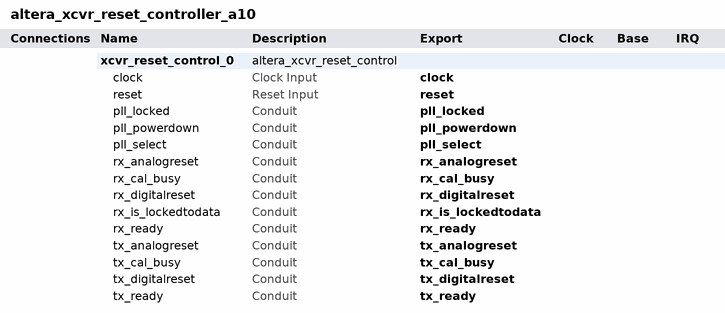
[diagram p0: system contents]
# Platform Designer (Qsys) system altera_xcvr_reset_controller_a10, Arria 10 10AX115S4F45E3SGE3
# Parameters at their usual value, and those the tool derives, are not listed.
package require -exact qsys 16.0
create_system altera_xcvr_reset_controller_a10
set_project_property DEVICE_FAMILY {Arria 10}
set_project_property DEVICE 10AX115S4F45E3SGE3

add_instance xcvr_reset_control_0 altera_xcvr_reset_control 16.0
set_instance_property xcvr_reset_control_0 AUTO_EXPORT true
set_instance_parameter_value xcvr_reset_control_0 CHANNELS 1
set_instance_parameter_value xcvr_reset_control_0 RX_PER_CHANNEL 0
set_instance_parameter_value xcvr_reset_control_0 SYS_CLK_IN_MHZ 125
set_instance_parameter_value xcvr_reset_control_0 TX_PLL_ENABLE 1
set_instance_parameter_value xcvr_reset_control_0 T_PLL_LOCK_HYST 10000
set_instance_parameter_value xcvr_reset_control_0 T_RX_ANALOGRESET 70000
set_instance_parameter_value xcvr_reset_control_0 T_TX_ANALOGRESET 70000
set_instance_parameter_value xcvr_reset_control_0 T_TX_DIGITALRESET 70000
set_instance_parameter_value xcvr_reset_control_0 gui_pll_cal_busy 0
set_instance_parameter_value xcvr_reset_control_0 gui_tx_auto_reset 1

# exported interfaces
add_interface clock clock sink
set_interface_property clock EXPORT_OF xcvr_reset_control_0.clock
add_interface pll_locked conduit end
set_interface_property pll_locked EXPORT_OF xcvr_reset_control_0.pll_locked
add_interface pll_powerdown conduit end
set_interface_property pll_powerdown EXPORT_OF xcvr_reset_control_0.pll_powerdown
add_interface pll_select conduit end
set_interface_property pll_select EXPORT_OF xcvr_reset_control_0.pll_select
add_interface reset reset sink
set_interface_property reset EXPORT_OF xcvr_reset_control_0.reset
add_interface rx_analogreset conduit end
set_interface_property rx_analogreset EXPORT_OF xcvr_reset_control_0.rx_analogreset
add_interface rx_cal_busy conduit end
set_interface_property rx_cal_busy EXPORT_OF xcvr_reset_control_0.rx_cal_busy
add_interface rx_digitalreset conduit end
set_interface_property rx_digitalreset EXPORT_OF xcvr_reset_control_0.rx_digitalreset
add_interface rx_is_lockedtodata conduit end
set_interface_property rx_is_lockedtodata EXPORT_OF xcvr_reset_control_0.rx_is_lockedtodata
add_interface rx_ready conduit end
set_interface_property rx_ready EXPORT_OF xcvr_reset_control_0.rx_ready
add_interface tx_analogreset conduit end
set_interface_property tx_analogreset EXPORT_OF xcvr_reset_control_0.tx_analogreset
add_interface tx_cal_busy conduit end
set_interface_property tx_cal_busy EXPORT_OF xcvr_reset_control_0.tx_cal_busy
add_interface tx_digitalreset conduit end
set_interface_property tx_digitalreset EXPORT_OF xcvr_reset_control_0.tx_digitalreset
add_interface tx_ready conduit end
set_interface_property tx_ready EXPORT_OF xcvr_reset_control_0.tx_ready

set_interconnect_requirement {$system} qsys_mm.clockCrossingAdapter HANDSHAKE
set_interconnect_requirement {$system} qsys_mm.insertDefaultSlave FALSE
set_interconnect_requirement {$system} qsys_mm.maxAdditionalLatency 1

save_system altera_xcvr_reset_controller_a10.qsys
